# Altium schematic sheet voeding.SchDoc
size A
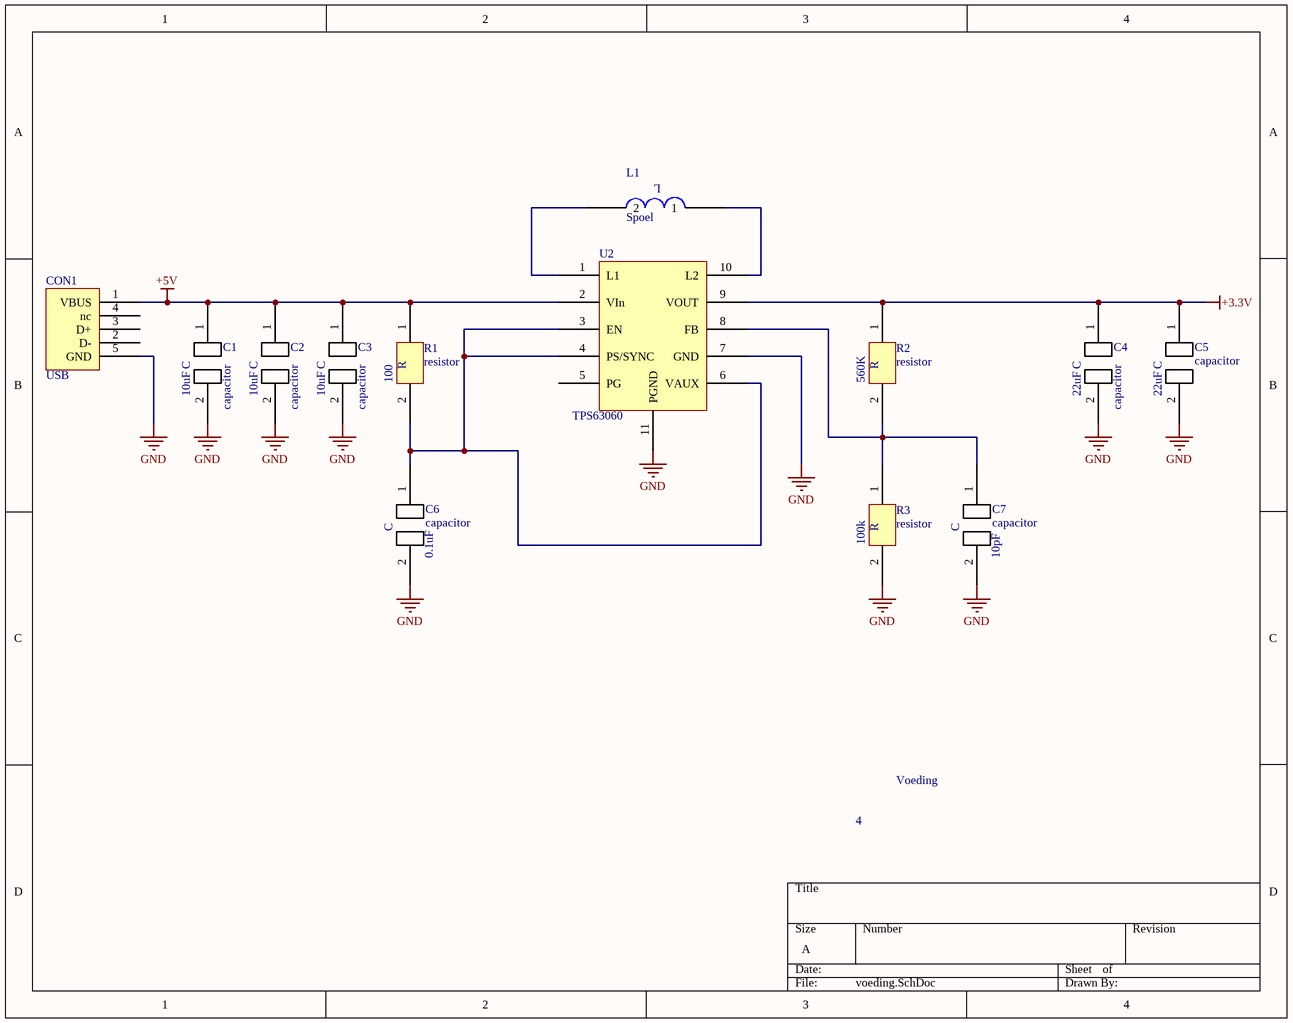
[diagram p0: voeding.SchDoc]

## Parts
C1  capacitor  value 10uF  [0603]
C2  capacitor  value 10uF  [0603]
C3  capacitor  value 10uF  [0603]
C4  capacitor  value 22uF  [0603]
C5  capacitor  value 22uF  [0603]
C6  capacitor  [0805]
C7  capacitor  [0805]
CON1  USB  [USB]
L1  Spoel  [Coilcraft , XFL4020-102]
R1  resistor  value 100  [0603]
R2  resistor  value 560K  [0603]
R3  resistor  value 100k  [0603]
U2  TPS63060  [TPS63060]

## Nets
+3.3V: C4.1 C5.1 R2.1 U2.9(VOUT)
+5V: C1.1 C2.1 C3.1 CON1.1(VBUS) R1.1 U2.2(VIn)
GND: C1.2 C2.2 C3.2 C4.2 C5.2 C6.2 C7.2 CON1.5(GND) R3.2 U2.7(GND) U2.11(PGND)
NetC6_1: C6.1 R1.2 U2.3(EN) U2.4(PS/SYNC) U2.6(VAUX)
NetC7_1: C7.1 R2.2 R3.1 U2.8(FB)
NetL1_1: L1.1 U2.10(L2)
NetL1_2: L1.2 U2.1(L1)

Not connected (* = marked no-connect by the designer): CON1 2(D-) 3(D+) 4(nc); U2 5(PG)

## Notes on the sheet
- 4
- Voeding
- (in symbol capacitor) C; 10pF; 0.1uF
- (in symbol resistor) R
- (in symbol Spoel) L